# Altium project TouchPad.PrjPcb
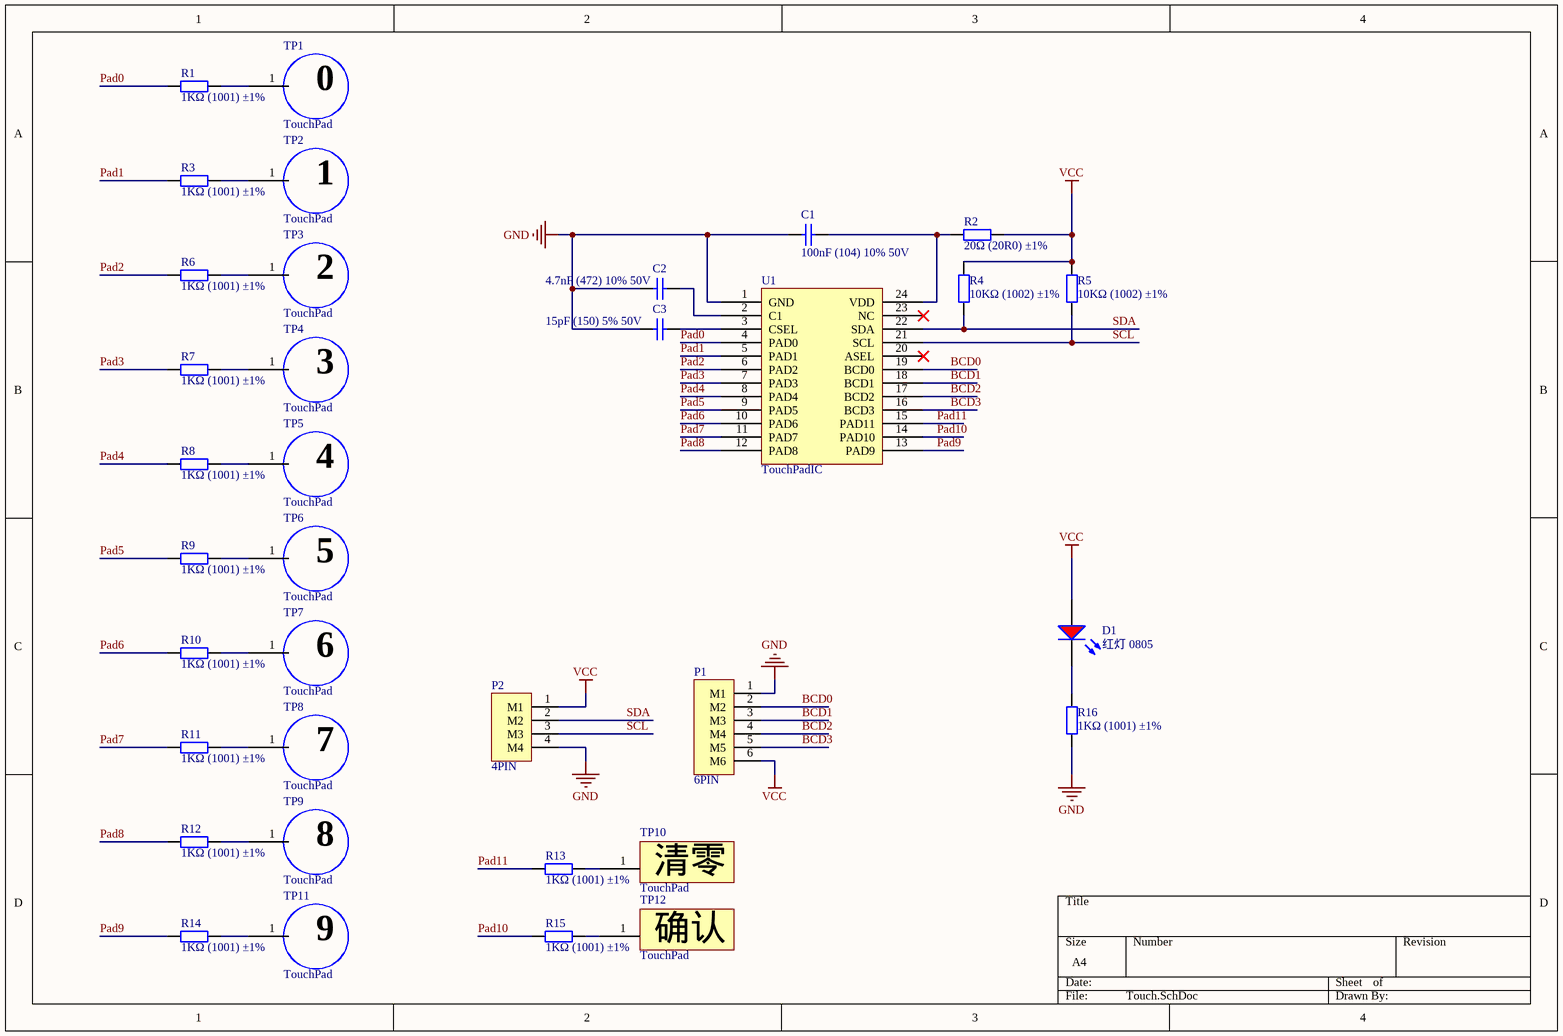
[diagram p0: Touch.SchDoc]
1 sheet, 35 parts. Net scope: global (net labels, ports and power ports of the same name join across sheets).
Board file: Touch.PcbDoc

## Sheet Touch.SchDoc
size A4; SheetNumber: 1; SheetTotal: 1

### Parts
C1  100nF (104) 10% 50V  [0603_C]
C2  4.7nF (472) 10% 50V  [0603_C]
C3  15pF (150) 5% 50V  [0603_C]
D1  红灯 0805  [0805_LED_S1]
P1  6PIN  [MX1.25WS-6P]
P2  4PIN  [PH2.0WS-4P]
R1  1KΩ (1001) ±1%  [0603_R]
R2  20Ω (20R0) ±1%  [0603_R]
R3  1KΩ (1001) ±1%  [0603_R]
R4  10KΩ (1002) ±1%  [0603_R]
R5  10KΩ (1002) ±1%  [0603_R]
R6  1KΩ (1001) ±1%  [0603_R]
R7  1KΩ (1001) ±1%  [0603_R]
R8  1KΩ (1001) ±1%  [0603_R]
R9  1KΩ (1001) ±1%  [0603_R]
R10  1KΩ (1001) ±1%  [0603_R]
R11  1KΩ (1001) ±1%  [0603_R]
R12  1KΩ (1001) ±1%  [0603_R]
R13  1KΩ (1001) ±1%  [0603_R]
R14  1KΩ (1001) ±1%  [0603_R]
R15  1KΩ (1001) ±1%  [0603_R]
R16  1KΩ (1001) ±1%  [0603_R]
TP1  TouchPad  [KEY0]
TP2  TouchPad  [Key1]
TP3  TouchPad  [Key2]
TP4  TouchPad  [Key3]
TP5  TouchPad  [KEY4]
TP6  TouchPad  [KEY5]
TP7  TouchPad  [KEY6]
TP8  TouchPad  [KEY7]
TP9  TouchPad  [KEY8]
TP10  TouchPad  [CANCEL]
TP11  TouchPad  [KEY9]
TP12  TouchPad  [confirm]
U1  TouchPadIC  [SOP127P1030X264-24N]

### Nets
GND: C1.1 C2.1 C3.2 P1.1(M1) P2.4(M4) R16.1 U1.1(GND)
VCC: D1.A P1.6(M6) P2.1(M1) R2.2 R4.2 R5.2
BCD0: P1.2(M2) U1.19(BCD0)
BCD1: P1.3(M3) U1.18(BCD1)
BCD2: P1.4(M4) U1.17(BCD2)
BCD3: P1.5(M5) U1.16(BCD3)
Pad0: R1.1 U1.4(PAD0)
Pad1: R3.1 U1.5(PAD1)
Pad2: R6.1 U1.6(PAD2)
Pad3: R7.1 U1.7(PAD3)
Pad4: R8.1 U1.8(PAD4)
Pad5: R9.1 U1.9(PAD5)
Pad6: R10.1 U1.10(PAD6)
Pad7: R11.1 U1.11(PAD7)
Pad8: R12.1 U1.12(PAD8)
Pad9: R14.1 U1.13(PAD9)
Pad10: R15.1 U1.14(PAD10)
Pad11: R13.1 U1.15(PAD11)
SCL: P2.3(M3) R5.1 U1.21(SCL)
SDA: P2.2(M2) R4.1 U1.22(SDA)
NetC1_2: C1.2 R2.1 U1.24(VDD)
NetC2_2: C2.2 U1.2(C1)
NetC3_1: C3.1 U1.3(CSEL)
NetD1_K: D1.K R16.2
NetR1_2: R1.2 TP1.1
NetR3_2: R3.2 TP2.1
NetR6_2: R6.2 TP3.1
NetR7_2: R7.2 TP4.1
NetR8_2: R8.2 TP5.1
NetR9_2: R9.2 TP6.1
NetR10_2: R10.2 TP7.1
NetR11_2: R11.2 TP8.1
NetR12_2: R12.2 TP9.1
NetR13_2: R13.2 TP10.1
NetR14_2: R14.2 TP11.1
NetR15_2: R15.2 TP12.1

Not connected (* = marked no-connect by the designer): U1 20(ASEL)* 23(NC)*

### Notes on the sheet
- (in symbol No) 清零
- (in symbol Touch0) 0
- (in symbol Touch2) 2
- (in symbol Touch3) 3
- (in symbol Touch4) 4
- (in symbol Touch5) 5
- (in symbol Touch6) 6
- (in symbol Touch7) 7
- (in symbol Touch8) 8
- (in symbol Touch9) 9
- (in symbol Yes) 确认

### Library data of the parts
C1 = 0603 100nF (104) 10% 50V: 贴片电容; ComponentLink1Description: 供应商链接; ComponentLink1URL: http://www.szlcsc.com/product/details_15331.html; Package: 0603; Supplier: LC; SuppliersPartNumber: C14663
C2 = 0603 4.7nF (472) 10% 50V: 贴片电容; ComponentLink1Description: 供应商链接; ComponentLink1URL: http://www.szlcsc.com/product/details_55004.html; Package: 0603; Supplier: LC; SuppliersPartNumber: C53987
C3 = 0603 15pF (150) 5% 50V: 贴片电容; ComponentLink1Description: 供应商链接; ComponentLink1URL: http://www.szlcsc.com/product/details_1996.html; Package: 0603; Supplier: LC; SuppliersPartNumber: C1644
D1 = 0805 红灯: 发光二极管; ComponentLink1Description: 供应商链接; ComponentLink1URL: http://www.szlcsc.com/product/details_2668.html; Package: 0805; Supplier: LC; SuppliersPartNumber: C2295
P1 = 接线端子-6PIN
P2 = 接线端子-4PIN
R1 R3 R6-R16 = 0603 1KΩ (1001) 1%: 贴片电阻; ComponentLink1Description: 供应商链接; ComponentLink1URL: http://www.szlcsc.com/product/details_21904.html; Package: 0603; Supplier: LC; SuppliersPartNumber: C21190
R2 = 0603 20Ω (20R0) 1%: 贴片电阻; ComponentLink1Description: 供应商链接; ComponentLink1URL: http://www.szlcsc.com/product/details_23677.html; Package: 0603; Supplier: LC; SuppliersPartNumber: C22950
R4 R5 = 0603 10KΩ (1002) 1%: 贴片电阻; ComponentLink1Description: 供应商链接; ComponentLink1URL: http://www.szlcsc.com/product/details_26547.html; Package: 0603; Supplier: LC; SuppliersPartNumber: C25804
TP1 = Touch0
TP2 = Touch1
TP3 = Touch2
TP4 = Touch3
TP5 = Touch4
TP6 = Touch5
TP7 = Touch6
TP8 = Touch7
TP9 = Touch8
TP10 = No
TP11 = Touch9
TP12 = Yes
U1 = XW12C